# EasyEDA Pro project Traffic Light.eprj

# Schematic Schematic1
Board Name: Board1; Create Date: 2025-01-07; Page Name: P1; Project Name: Traffic Light; Schematic Name: Schematic1; Update Date: 2025-01-07; Company: EasyEDA.com; Page Size: A4; Version: V1.0
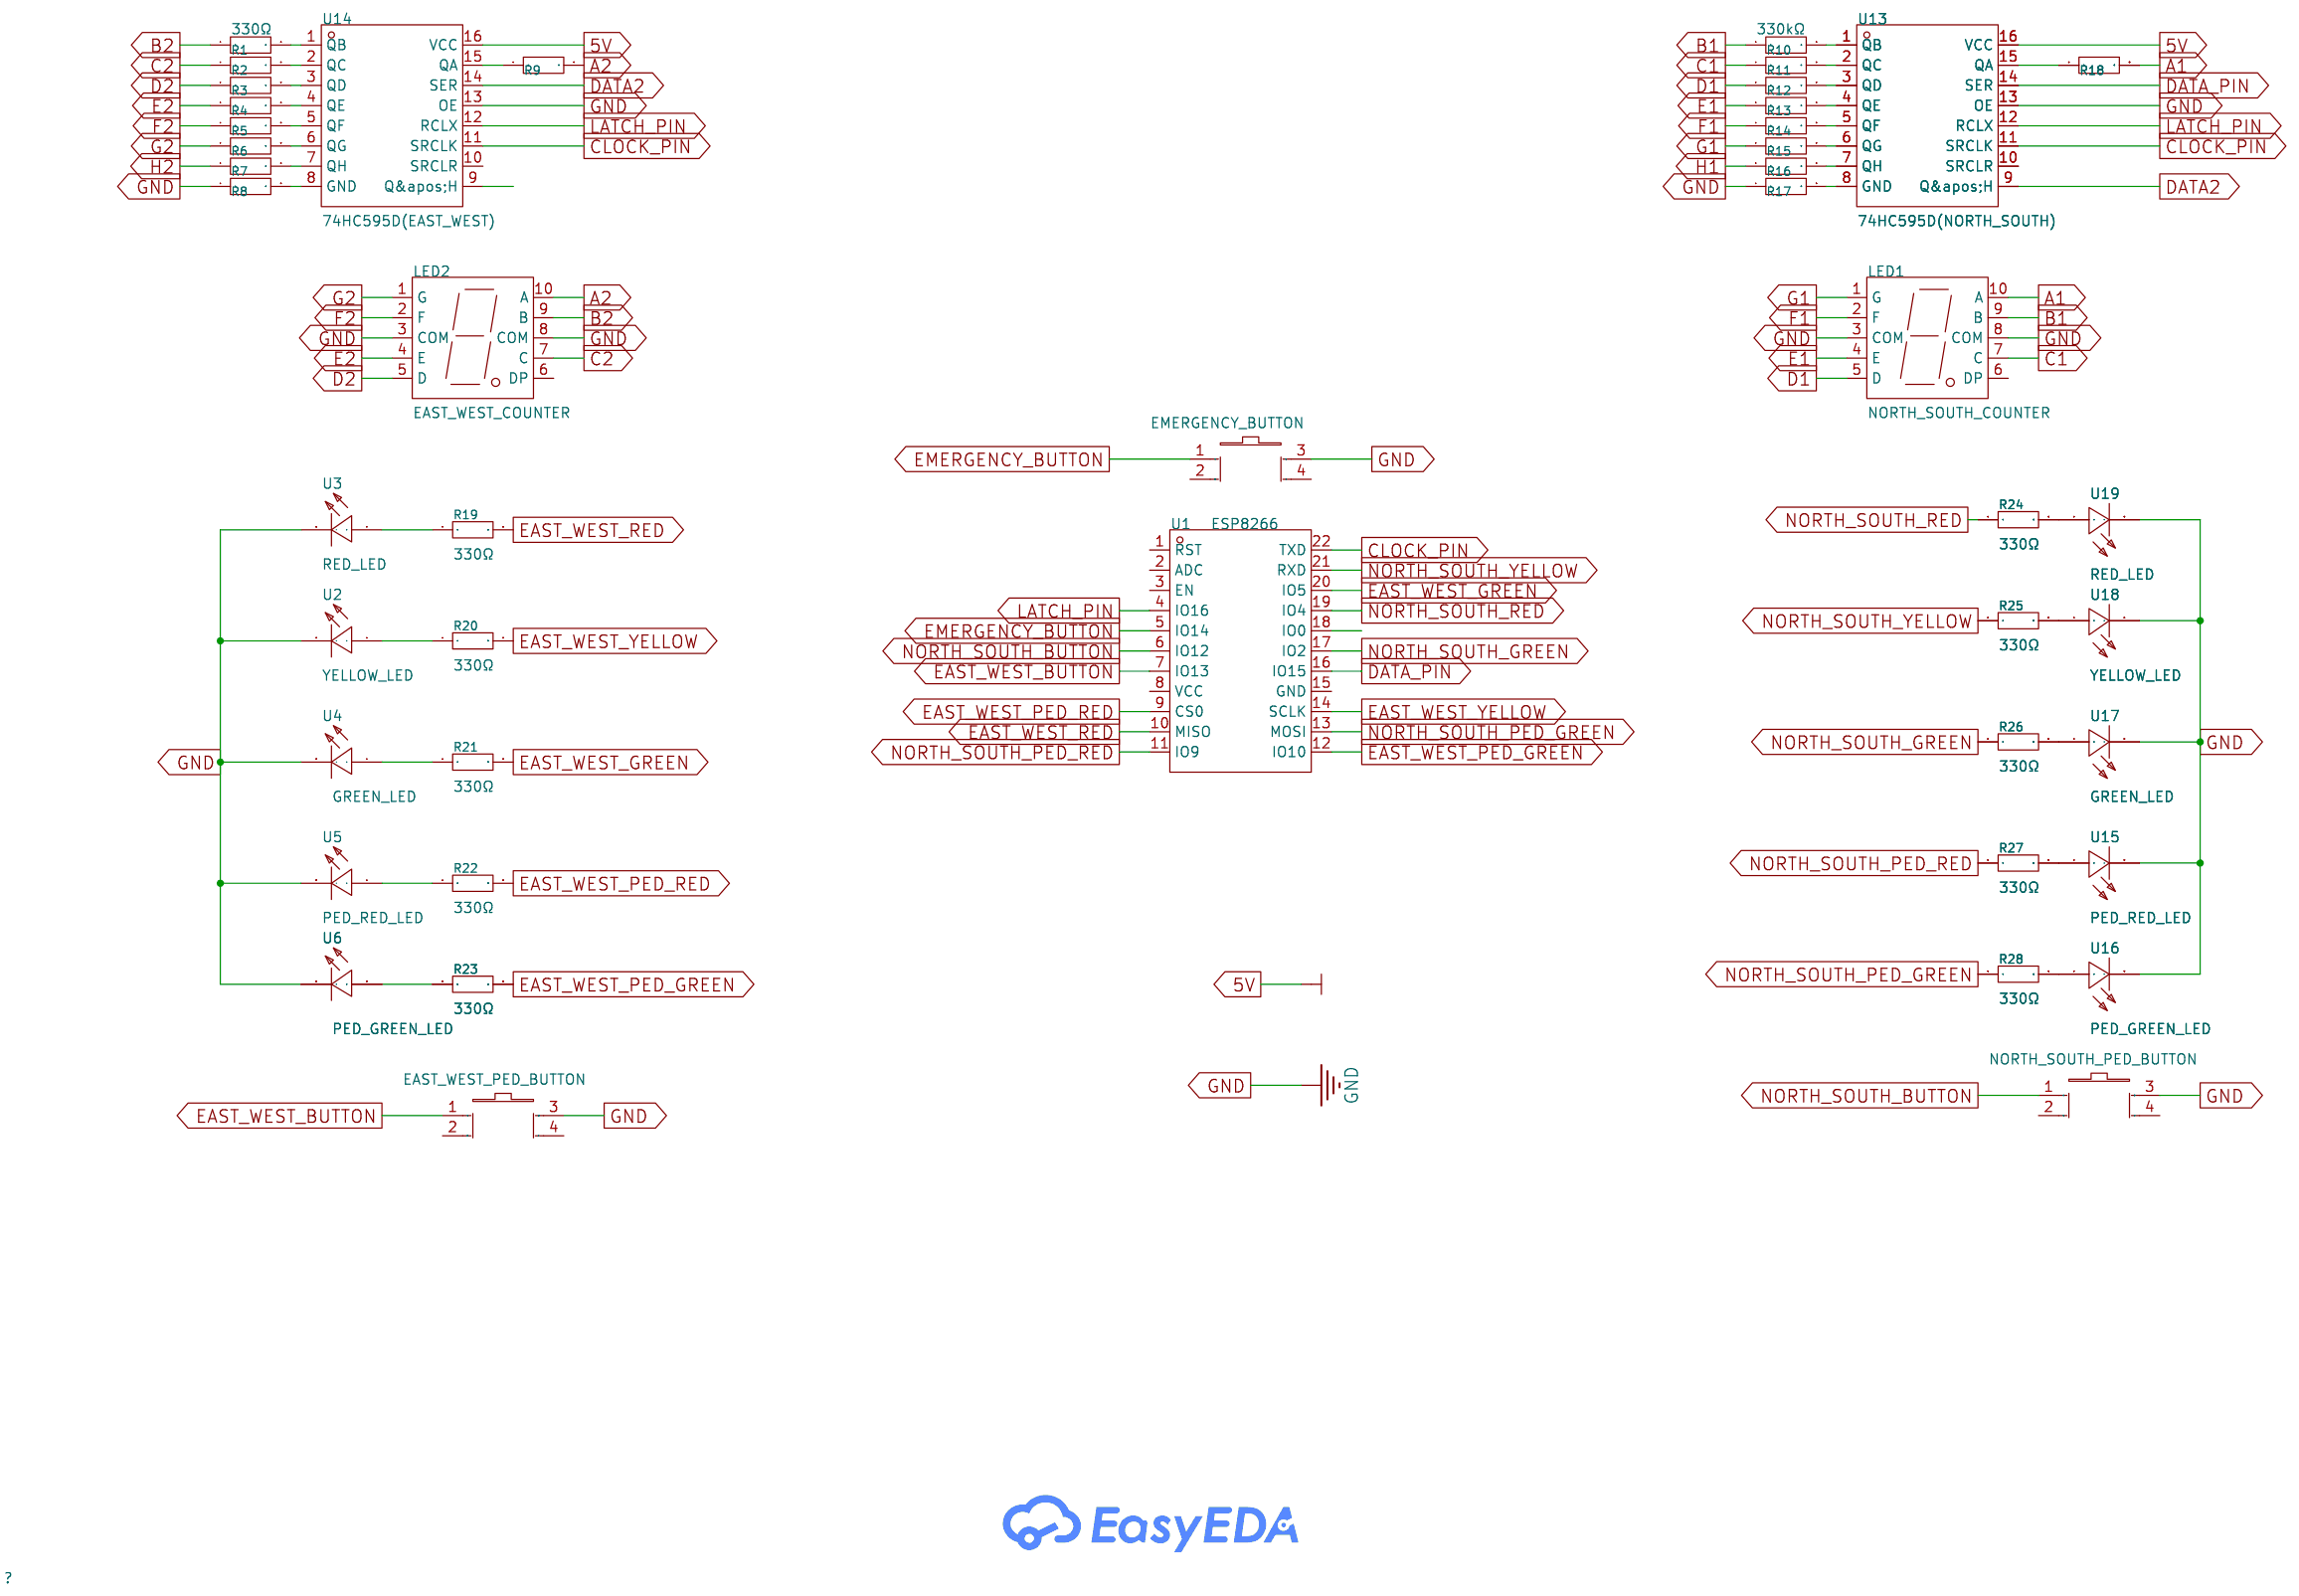
[diagram p0: schematic sheet]

## Parts
EAST_WEST_PED_BUTTON  轻触开关6*6*9  [KEY-TH_4P-L6.0-W6.0-P4.50]
EMERGENCY_BUTTON  轻触开关6*6*9  [KEY-TH_4P-L6.0-W6.0-P4.50]
LED1  NORTH_SOUTH_COUNTER  [LED-SEG-TH_10P-L10.0-W12.9-P2.54-S7.52-TL]
LED2  EAST_WEST_COUNTER  [LED-SEG-TH_10P-L10.0-W12.9-P2.54-S7.52-TL]
NORTH_SOUTH_PED_BUTTON  轻触开关6*6*9  [KEY-TH_4P-L6.0-W6.0-P4.50]
R1  330Ω  [R0603]
R2  8.2kΩ  [R0603]
R3  8.2kΩ  [R0603]
R4  8.2kΩ  [R0603]
R5  8.2kΩ  [R0603]
R6  8.2kΩ  [R0603]
R7  8.2kΩ  [R0603]
R8  8.2kΩ  [R0603]
R9  8.2kΩ  [R0603]
R10  330kΩ  [R0603]
R11  8.2kΩ  [R0603]
R12  8.2kΩ  [R0603]
R13  8.2kΩ  [R0603]
R14  8.2kΩ  [R0603]
R15  8.2kΩ  [R0603]
R16  8.2kΩ  [R0603]
R17  8.2kΩ  [R0603]
R18  8.2kΩ  [R0603]
R19  330Ω  [R0603]
R20  330Ω  [R0603]
R21  330Ω  [R0603]
R22  330Ω  [R0603]
R23  330Ω  [R0603]
R24  330Ω  [R0603]
R25  330Ω  [R0603]
R26  330Ω  [R0603]
R27  330Ω  [R0603]
R28  330Ω  [R0603]
U1  ESP8266  [WIFIM-SMD_22P-L24.0-W16.0-P2.00-SMDESP8266-12F]
U2  YELLOW_LED  [LED-TH_BD4.0-P2.54-FD_RED]
U3  RED_LED  [LED-TH_BD4.0-P2.54-FD_RED]
U4  GREEN_LED  [LED-TH_BD4.0-P2.54-FD_RED]
U5  PED_RED_LED  [LED-TH_BD4.0-P2.54-FD_RED]
U6  PED_GREEN_LED  [LED-TH_BD4.0-P2.54-FD_RED]
U13  74HC595D(NORTH_SOUTH)  [SOP-16_L9.9-W3.9-P1.27-LS6.0-BL]
U14  74HC595D(EAST_WEST)  [SOP-16_L9.9-W3.9-P1.27-LS6.0-BL]
U15  PED_RED_LED  [LED-TH_BD4.0-P2.54-FD_RED]
U16  PED_GREEN_LED  [LED-TH_BD4.0-P2.54-FD_RED]
U17  GREEN_LED  [LED-TH_BD4.0-P2.54-FD_RED]
U18  YELLOW_LED  [LED-TH_BD4.0-P2.54-FD_RED]
U19  RED_LED  [LED-TH_BD4.0-P2.54-FD_RED]

## Library data of the parts
EAST_WEST_PED_BUTTON EMERGENCY_BUTTON NORTH_SOUTH_PED_BUTTON = 轻触开关6*6*9: Supplier Part: C70910; Supplier Footprint: SMD; JLCPCB Part Class: Extended Part; Supplier: LCSC
LED1 LED2 = MHDC3911SRBW: LCSC Part Name: 0.39直插数码管共阴单八红色光; Supplier Part: C401121; Manufacturer: MEIHUA(美华); Supplier Footprint: 插件; JLCPCB Part Class: Extended Part; Datasheet: https://atta.szlcsc.com/upload/public/pdf/source/20190702/C401121_769E048B481D068B857F847C636A2363.pdf; Supplier: LCSC; Number of Characters: 1Bit; Module Size: 12.86mmx10mmx7mm; Power Dissipation: 80mW; Luminous Color: Red; LED Polarity: 共阴极; Digit/Alpha Size(inch): 0.39
R1-R28 = 0603WAF8201T5E: LCSC Part Name: 8.2kΩ ±1% 100mW 厚膜电阻; Supplier Part: C25981; Manufacturer: UNI-ROYAL(厚声); Supplier Footprint: 0603; JLCPCB Part Class: Basic Part; Datasheet: https://atta.szlcsc.com/upload/public/pdf/source/20200306/C422600_1E6D84923E4A46A82E41ADD87F860B5C.pdf; Supplier: LCSC; Type: Thick Film Resistors; Tolerance: ±1%; Temperature Coefficient: ±100ppm/℃; Operating Temperature Range: -55℃~+155℃
U1 = SMDESP8266-12F: Supplier Part: C9900003458; Supplier Footprint: SMD; JLCPCB Part Class: Extended Part; Supplier: LCSC
U2-U6 U15-U19 = LED: Supplier Part: C9900015665; Supplier Footprint: SIP-2P; JLCPCB Part Class: Extended Part; Supplier: LCSC
U13 U14 = 74HC595D(XBLW): Supplier Part: C20612517; Manufacturer: XBLW(芯伯乐); Supplier Footprint: SOP-16; JLCPCB Part Class: Extended Part; Datasheet: https://atta.szlcsc.com/upload/public/pdf/source/20240126/3FCCF9107705B7A8DF3AF1CA840C509F.pdf; Supplier: LCSC; Function: 串行至串行或并行; Supply Voltage: 2V~6V; Clock Frequency: 25MHz; Number of Elements: 1; Number of Bits per Element: 8; Output Type: Tri-State; Operating Temperature: -40℃~+105℃

## Nets
5V: U13.16(VCC) U14.16(VCC)
GND: EAST_WEST_PED_BUTTON.3 EMERGENCY_BUTTON.3 LED1.3(COM) LED1.8(COM) LED2.3(COM) LED2.8(COM) NORTH_SOUTH_PED_BUTTON.3 R8.1 R17.1 U2.2(-) U3.2(-) U4.2(-) U5.2(-) U6.2(-) U13.13(OE) U14.13(OE) U15.2(-) U16.2(-) U17.2(-) U18.2(-) U19.2(-)
A1: LED1.10(A) R18.2
A2: LED2.10(A) R9.1 R9.2 U14.15(QA)
B1: LED1.9(B) R10.1
B2: LED2.9(B) R1.1
C1: LED1.7(C) R11.1
C2: LED2.7(C) R2.1
CLOCK_PIN: U1.22(TXD) U13.11(SRCLK) U14.11(SRCLK)
D1: LED1.5(D) R12.1
D2: LED2.5(D) R3.1
DATA2: U13.9(Q&apos;H) U14.14(SER)
DATA_PIN: U1.16(IO15) U13.14(SER)
E1: LED1.4(E) R13.1
E2: LED2.4(E) R4.1
EAST_WEST_BUTTON: EAST_WEST_PED_BUTTON.1 U1.7(IO13)
EAST_WEST_GREEN: R21.2 U1.20(IO5)
EAST_WEST_PED_GREEN: R23.2 U1.12(IO10)
EAST_WEST_PED_RED: R22.2 U1.9(CS0)
EAST_WEST_RED: R19.2 U1.10(MISO)
EAST_WEST_YELLOW: R20.2 U1.14(SCLK)
EMERGENCY_BUTTON: EMERGENCY_BUTTON.1 U1.5(IO14)
F1: LED1.2(F) R14.1
F2: LED2.2(F) R5.1
G1: LED1.1(G) R15.1
G2: LED2.1(G) R6.1
H1: R16.1
H2: R7.1
LATCH_PIN: U1.4(IO16) U13.12(RCLX) U14.12(RCLX)
NORTH_SOUTH_BUTTON: NORTH_SOUTH_PED_BUTTON.1 U1.6(IO12)
NORTH_SOUTH_GREEN: R26.1 U1.17(IO2)
NORTH_SOUTH_PED_GREEN: R28.1 U1.13(MOSI)
NORTH_SOUTH_PED_RED: R27.1 U1.11(IO9)
NORTH_SOUTH_RED: R24.1 U1.19(IO4)
NORTH_SOUTH_YELLOW: R25.1 U1.21(RXD)
Net-(R1-2): R1.2 U14.1(QB)
Net-(R2-2): R2.2 U14.2(QC)
Net-(R3-2): R3.2 U14.3(QD)
Net-(R4-2): R4.2 U14.4(QE)
Net-(R5-2): R5.2 U14.5(QF)
Net-(R6-2): R6.2 U14.6(QG)
Net-(R7-2): R7.2 U14.7(QH)
Net-(R8-2): R8.2 U14.8(GND)
Net-(R10-2): R10.2 U13.1(QB)
Net-(R11-2): R11.2 U13.2(QC)
Net-(R12-2): R12.2 U13.3(QD)
Net-(R13-2): R13.2 U13.4(QE)
Net-(R14-2): R14.2 U13.5(QF)
Net-(R15-2): R15.2 U13.6(QG)
Net-(R16-2): R16.2 U13.7(QH)
Net-(R17-2): R17.2 U13.8(GND)
Net-(R18-1): R18.1 U13.15(QA)
Net-(R19-1): R19.1 U3.1(+)
Net-(R20-1): R20.1 U2.1(+)
Net-(R21-1): R21.1 U4.1(+)
Net-(R22-1): R22.1 U5.1(+)
Net-(R23-1): R23.1 U6.1(+)
Net-(R24-2): R24.2 U19.1(+)
Net-(R25-2): R25.2 U18.1(+)
Net-(R26-2): R26.2 U17.1(+)
Net-(R27-2): R27.2 U15.1(+)
Net-(R28-2): R28.2 U16.1(+)

Not connected (* = marked no-connect by the designer): EAST_WEST_PED_BUTTON 2 4; EMERGENCY_BUTTON 2 4; LED1 6(DP); LED2 6(DP); NORTH_SOUTH_PED_BUTTON 2 4; U1 1(RST) 2(ADC) 3(EN) 8(VCC) 15(GND) 18(IO0); U13 10(SRCLR); U14 9(Q&apos;H) 10(SRCLR)
